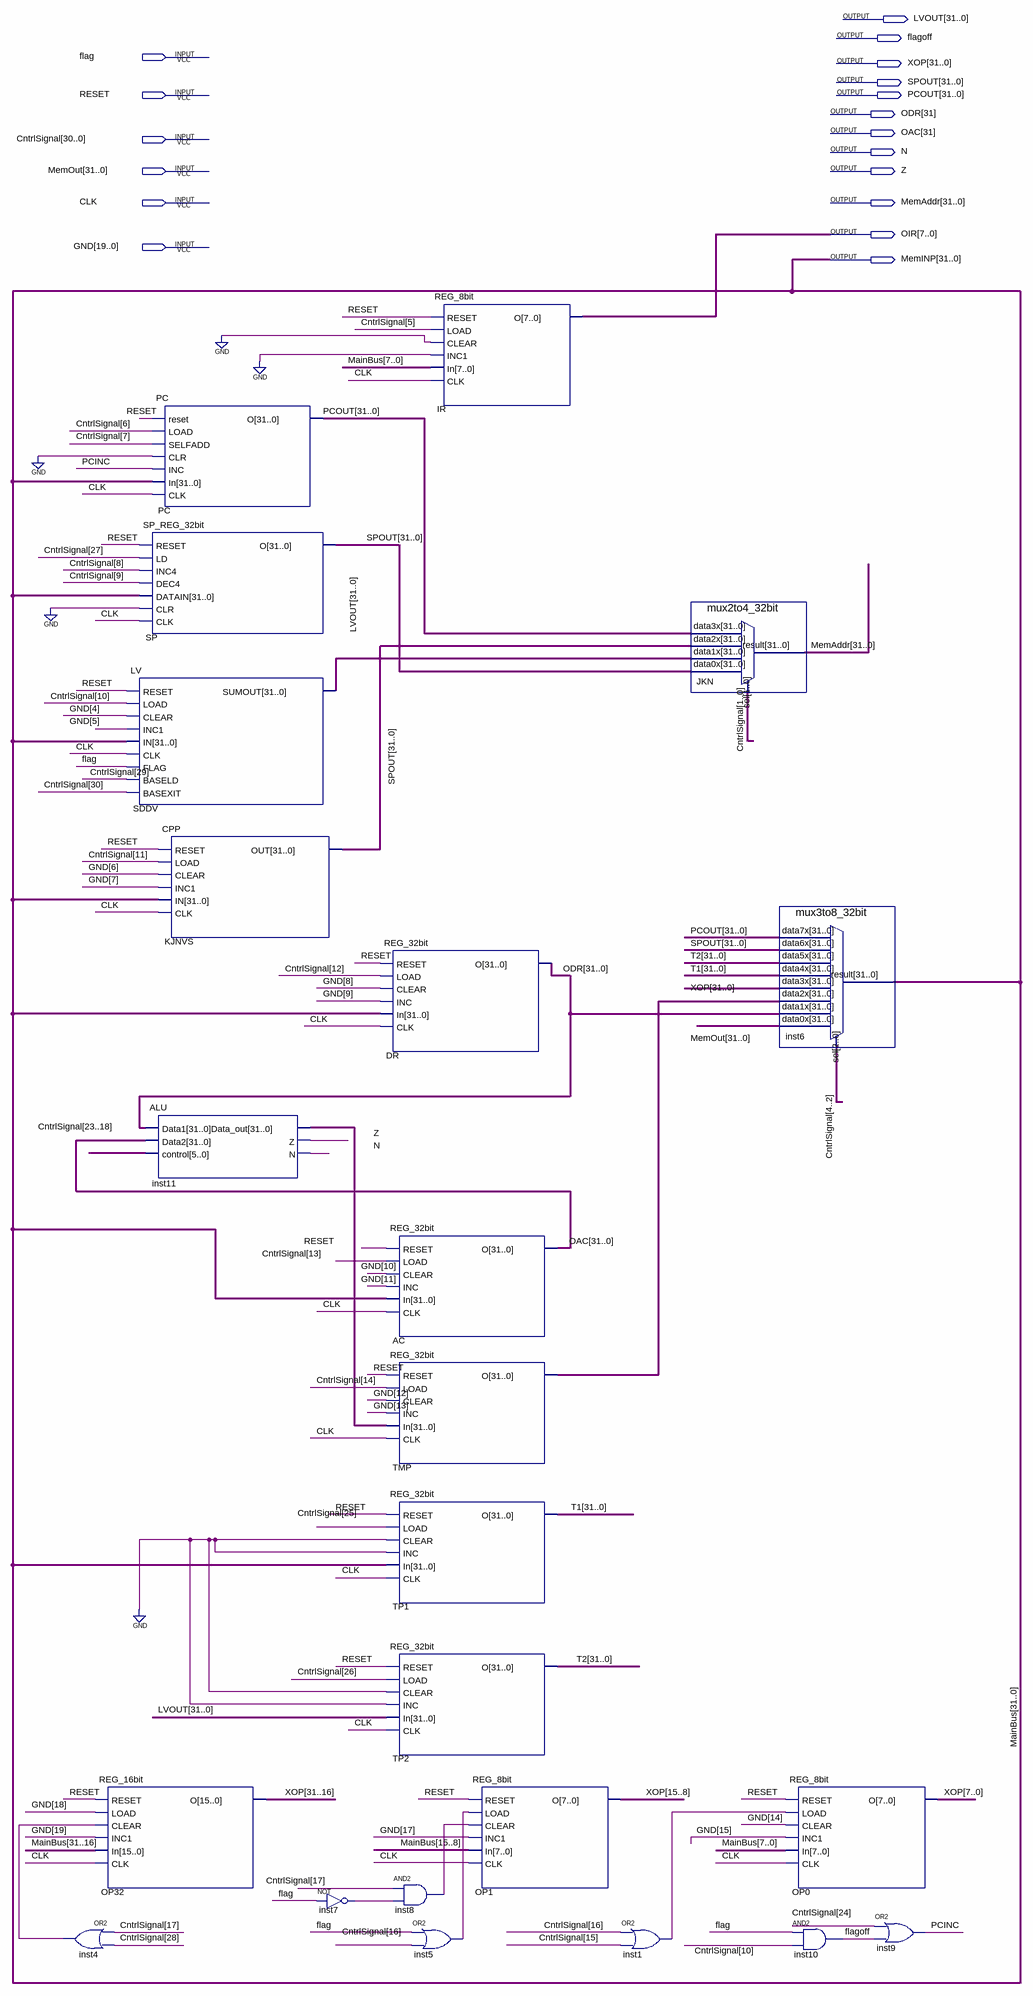
[diagram p0: schematic sheet]
// Quartus schematic DataPath.bdf as structural Verilog: 23 symbols, 18 pins
module DataPath (
  input  flag,
  input  RESET,
  input  [30:0] CntrlSignal,
  input  [31:0] MemOut,
  input  CLK,
  input  [19:0] GND,
  output [31:0] LVOUT,
  output flagoff,
  output [31:0] XOP,
  output [31:0] SPOUT,
  output [31:0] PCOUT,
  output [31:0] ODR,
  output [31:0] OAC,
  output N,
  output Z,
  output [31:0] MemAddr,
  output [7:0] OIR,
  output [31:0] MemINP
);

  wire inst1_out, inst4_out, inst5_out, inst7_out, inst8_out, PCINC;
  wire [31:0] inst11_data_out, KJNVS_out, T1, T2, TMP_o;

  or inst4 (inst4_out, CntrlSignal[17], CntrlSignal[28]);
  SP_REG_32bit SP (
    .RESET(RESET), .LD(CntrlSignal[27]), .INC4(CntrlSignal[8]), .DEC4(CntrlSignal[9]), .DATAIN(MemINP),
    .CLR(1'b0), .CLK(CLK), .O(SPOUT));
  LV SDDV (
    .RESET(RESET), .LOAD(CntrlSignal[10]), .CLEAR(GND[4]), .INC1(GND[5]), .IN(MemINP), .CLK(CLK),
    .FLAG(flag), .BASELD(CntrlSignal[29]), .BASEXIT(CntrlSignal[30]), .SUMOUT(LVOUT));
  REG_16bit OP32 (
    .RESET(RESET), .LOAD(GND[18]), .CLEAR(inst4_out), .INC1(GND[19]), .In(MemINP[31:16]), .CLK(CLK),
    .O(XOP[31:16]));
  PC PC (
    .reset(RESET), .LOAD(CntrlSignal[6]), .SELFADD(CntrlSignal[7]), .CLR(1'b0), .INC(PCINC), .In(MemINP),
    .CLK(CLK), .O(PCOUT));
  CPP KJNVS (
    .RESET(RESET), .LOAD(CntrlSignal[11]), .CLEAR(GND[6]), .INC1(GND[7]), .IN(MemINP), .CLK(CLK),
    .OUT(KJNVS_out));
  ALU inst11 (.Data1(ODR), .Data2(OAC), .control(CntrlSignal[23:18]), .Data_out(inst11_data_out), .Z(Z), .N(N));
  not inst7 (inst7_out, flag);
  REG_32bit DR (.RESET(RESET), .LOAD(CntrlSignal[12]), .CLEAR(GND[8]), .INC(GND[9]), .In(MemINP), .CLK(CLK), .O(ODR));
  REG_32bit AC (.RESET(RESET), .LOAD(CntrlSignal[13]), .CLEAR(GND[10]), .INC(GND[11]), .In(MemINP), .CLK(CLK), .O(OAC));
  REG_32bit TMP (
    .RESET(RESET), .LOAD(CntrlSignal[14]), .CLEAR(GND[12]), .INC(GND[13]), .In(inst11_data_out), .CLK(CLK),
    .O(TMP_o));
  REG_32bit TP1 (.RESET(RESET), .LOAD(CntrlSignal[25]), .CLEAR(1'b0), .INC(1'b0), .In(MemINP), .CLK(CLK), .O(T1));
  REG_32bit TP2 (.RESET(RESET), .LOAD(CntrlSignal[26]), .CLEAR(1'b0), .INC(1'b0), .In(LVOUT), .CLK(CLK), .O(T2));
  and inst8 (inst8_out, CntrlSignal[17], inst7_out);
  REG_8bit IR (.RESET(RESET), .LOAD(CntrlSignal[5]), .CLEAR(1'b0), .INC1(1'b0), .In(MemINP[7:0]), .CLK(CLK), .O(OIR));
  or inst5 (inst5_out, flag, CntrlSignal[16]);
  REG_8bit OP1 (
    .RESET(RESET), .LOAD(inst5_out), .CLEAR(inst8_out), .INC1(GND[17]), .In(MemINP[15:8]), .CLK(CLK),
    .O(XOP[15:8]));
  or inst1 (inst1_out, CntrlSignal[16], CntrlSignal[15]);
  mux2to4_32bit JKN (
    .data3x(PCOUT), .data2x(KJNVS_out), .data1x(LVOUT), .data0x(SPOUT), .sel(CntrlSignal[1:0]),
    .result(MemAddr));
  mux3to8_32bit inst6 (
    .data7x(PCOUT), .data6x(SPOUT), .data5x(T2), .data4x(T1), .data3x(XOP), .data2x(TMP_o), .data1x(ODR),
    .data0x(MemOut), .sel(CntrlSignal[4:2]), .result(MemINP));
  REG_8bit OP0 (
    .RESET(RESET), .LOAD(inst1_out), .CLEAR(GND[14]), .INC1(GND[15]), .In(MemINP[7:0]), .CLK(CLK),
    .O(XOP[7:0]));
  and inst10 (flagoff, flag, CntrlSignal[10]);
  or inst9 (PCINC, CntrlSignal[24], flagoff);

  // Other names for the same wires on the sheet: MainBus[31:0] = MemINP
endmodule
